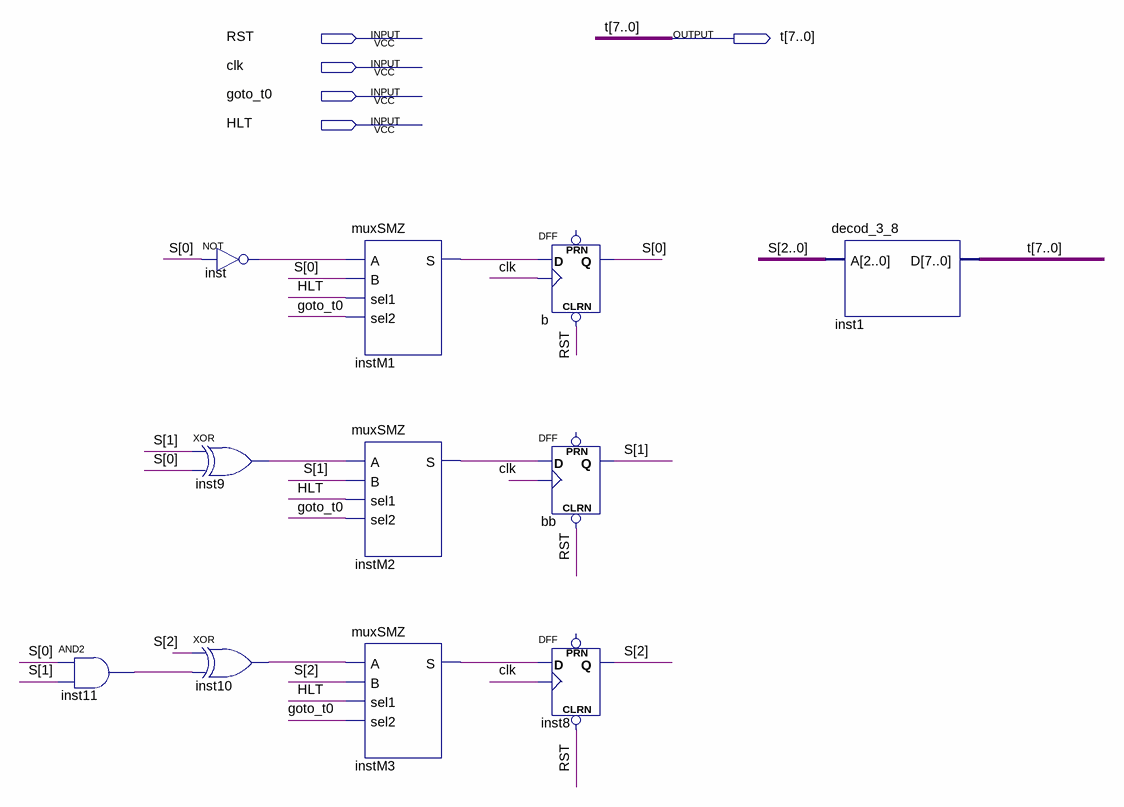
[diagram p0: schematic sheet]
// Quartus schematic temporizador.bdf as structural Verilog: 11 symbols, 5 pins
module temporizador (
  input  RST,
  input  clk,
  input  goto_t0,
  input  HLT,
  output [7:0] t
);

  wire inst9_out, inst10_out, inst11_out, inst_out, instM1_s, instM2_s, instM3_s;
  wire [2:0] S;

  and inst11 (inst11_out, S[0], S[1]);
  not inst (inst_out, S[0]);
  xor inst9 (inst9_out, S[1], S[0]);
  xor inst10 (inst10_out, S[2], inst11_out);
  muxSMZ instM1 (.A(inst_out), .B(S[0]), .sel1(HLT), .sel2(goto_t0), .S(instM1_s));
  muxSMZ instM2 (.A(inst9_out), .B(S[1]), .sel1(HLT), .sel2(goto_t0), .S(instM2_s));
  muxSMZ instM3 (.A(inst10_out), .B(S[2]), .sel1(HLT), .sel2(goto_t0), .S(instM3_s));
  DFF b (.CLRN(RST), .CLK(clk), .D(instM1_s), .Q(S[0]));  // open: PRN
  DFF bb (.CLRN(RST), .CLK(clk), .D(instM2_s), .Q(S[1]));  // open: PRN
  DFF inst8 (.CLRN(RST), .CLK(clk), .D(instM3_s), .Q(S[2]));  // open: PRN
  decod_3_8 inst1 (.A(S), .D(t));
endmodule
